# Altium schematic sheet Mechanical-Keyboard.SchDoc
size A4; SheetTotal: 2
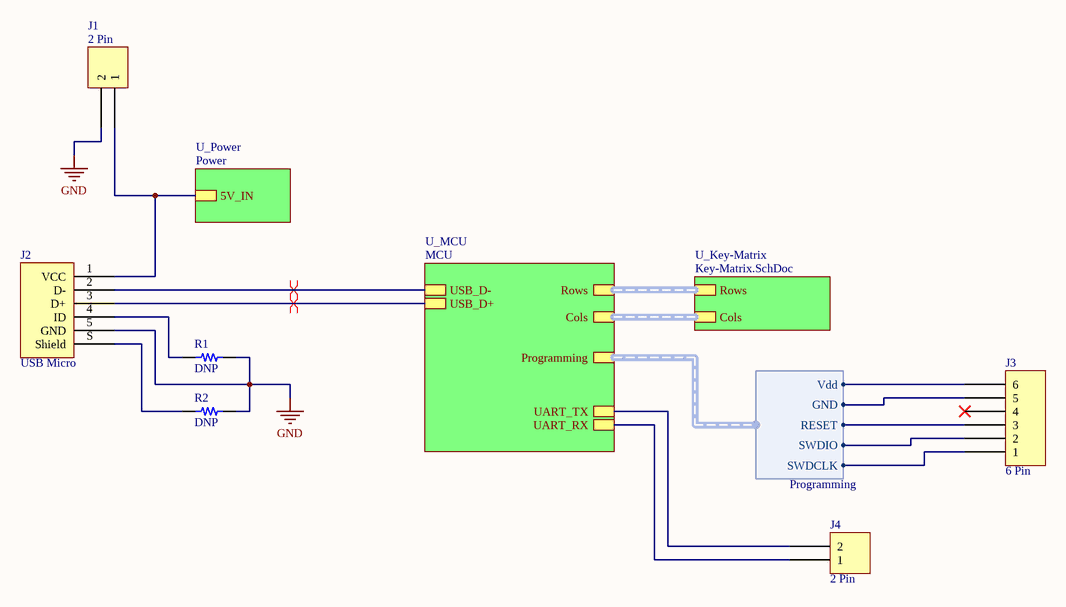
[diagram p0: Mechanical-Keyboard.SchDoc]

## Parts
J1  2 Pin  [HDR1X2]
J2  USB Micro  [FCI USB 10033526-N3212LF]
J3  6 Pin  [HDR1X6]
J4  2 Pin  [HDR1X2]
R1  DNP  [RES 0603_1608]
R2  DNP  [RES 0603_1608]

## Sub-sheets
U_Key-Matrix = Key-Matrix.SchDoc: Rows (harness Rows), Cols (harness Cols)
U_MCU = MCU: USB_D-, USB_D+, Rows (harness Rows), Cols (harness Rows), Programming (harness Programming), UART_TX, UART_RX
U_Power = Power: 5V_IN

## Harnesses
Programming: Vdd, GND, RESET, SWDIO, SWDCLK

## Nets
GND: J1.2 J2.5(GND) R1.2 R2.2
NetJ1_1: J1.1 J2.1(VCC) ; sheet U_Power/5V_IN
NetJ2_2: J2.2(D-) ; sheet U_MCU/USB_D-
NetJ2_3: J2.3(D+) ; sheet U_MCU/USB_D+
NetJ2_4: J2.4(ID) R1.1
NetJ2_S: J2.S(Shield) R2.1
NetJ3_1: J3.1 ; sheet U_MCU/Programming.SWDCLK
NetJ3_2: J3.2 ; sheet U_MCU/Programming.SWDIO
NetJ3_3: J3.3 ; sheet U_MCU/Programming.RESET
NetJ3_5: J3.5 ; sheet U_MCU/Programming.GND
NetJ3_6: J3.6 ; sheet U_MCU/Programming.Vdd
NetJ4_1: J4.1 ; sheet U_MCU/UART_RX
NetJ4_2: J4.2 ; sheet U_MCU/UART_TX

Not connected (* = marked no-connect by the designer): J3 4*

## Buses and harness runs
harness sheet U_Key-Matrix/Cols = sheet U_MCU/Cols
harness sheet U_Key-Matrix/Rows = sheet U_MCU/Rows

## Layout directives
differential pair; differential pair class USB_PHY: NetJ2_2, NetJ2_3

## Library data of the parts
J2 = USB 2.0 Type B Micro
R1 R2 = Resistor: SMT Resistor